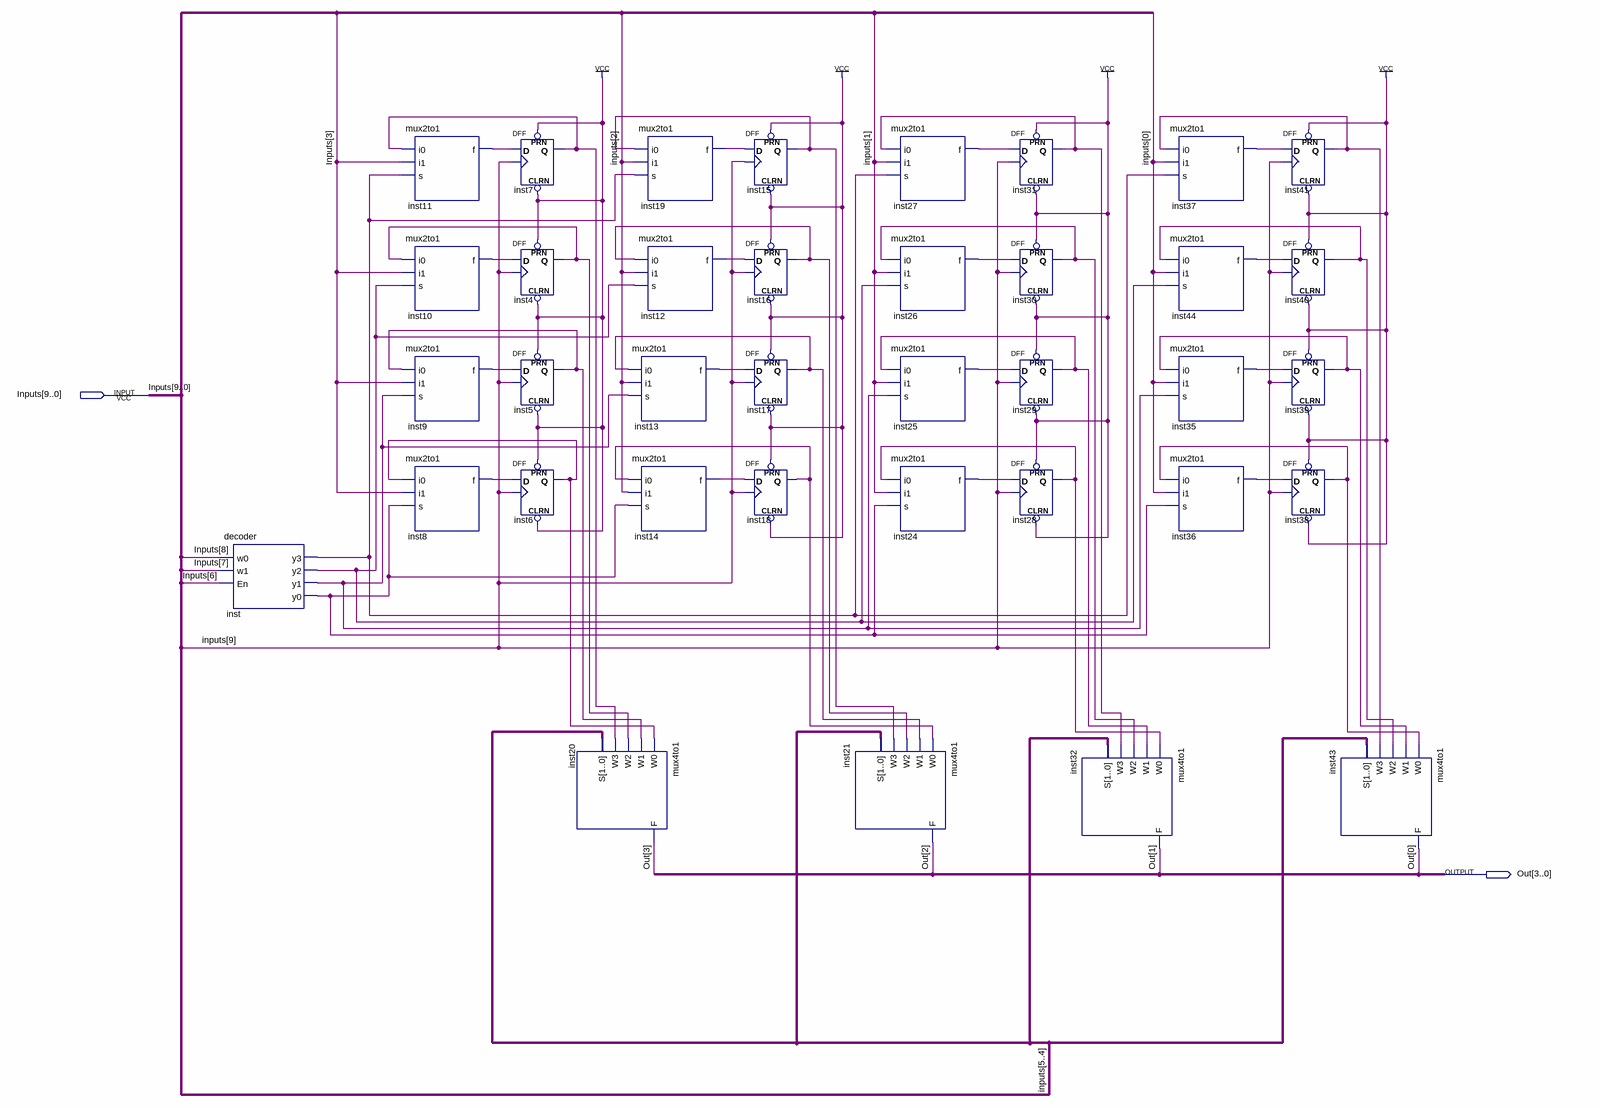
[diagram p0: schematic sheet]
// Quartus schematic regfile.bdf as structural Verilog: 37 symbols, 2 pins
module regfile (
  input  [9:0] Inputs,
  output [3:0] Out
);

  wire inst4_q, inst5_q, inst6_q, inst7_q, inst8_f, inst9_f, inst10_f, inst11_f, inst12_f, inst13_f,
       inst14_f, inst15_q, inst16_q, inst17_q, inst18_q, inst19_f, inst24_f, inst25_f, inst26_f, inst27_f,
       inst28_q, inst29_q, inst30_q, inst31_q, inst35_f, inst36_f, inst37_f, inst38_q, inst39_q, inst40_q,
       inst41_q, inst44_f, inst_y0, inst_y1, inst_y2, inst_y3;

  decoder inst (.w0(Inputs[8]), .w1(Inputs[7]), .En(Inputs[6]), .y3(inst_y3), .y2(inst_y2), .y1(inst_y1), .y0(inst_y0));
  mux2to1 inst11 (.i0(inst7_q), .i1(Inputs[3]), .s(inst_y3), .f(inst11_f));
  mux2to1 inst10 (.i0(inst4_q), .i1(Inputs[3]), .s(inst_y2), .f(inst10_f));
  mux2to1 inst9 (.i0(inst5_q), .i1(Inputs[3]), .s(inst_y1), .f(inst9_f));
  mux2to1 inst8 (.i0(inst6_q), .i1(Inputs[3]), .s(inst_y0), .f(inst8_f));
  DFF inst7 (.CLRN(1'b1), .CLK(Inputs[9]), .D(inst11_f), .PRN(1'b1), .Q(inst7_q));
  DFF inst4 (.CLRN(1'b1), .CLK(Inputs[9]), .D(inst10_f), .PRN(1'b1), .Q(inst4_q));
  DFF inst5 (.CLRN(1'b1), .CLK(Inputs[9]), .D(inst9_f), .PRN(1'b1), .Q(inst5_q));
  DFF inst6 (.CLRN(1'b1), .CLK(Inputs[9]), .D(inst8_f), .PRN(1'b1), .Q(inst6_q));
  mux4to1 inst20 (.W0(inst6_q), .W1(inst5_q), .W2(inst4_q), .W3(inst7_q), .S(Inputs[5:4]), .F(Out[3]));
  mux2to1 inst19 (.i0(inst15_q), .i1(Inputs[2]), .s(inst_y3), .f(inst19_f));
  mux2to1 inst12 (.i0(inst16_q), .i1(Inputs[2]), .s(inst_y2), .f(inst12_f));
  mux2to1 inst13 (.i0(inst17_q), .i1(Inputs[2]), .s(inst_y1), .f(inst13_f));
  mux2to1 inst14 (.i0(inst18_q), .i1(Inputs[2]), .s(inst_y0), .f(inst14_f));
  DFF inst15 (.CLRN(1'b1), .CLK(Inputs[9]), .D(inst19_f), .PRN(1'b1), .Q(inst15_q));
  DFF inst16 (.CLRN(1'b1), .CLK(Inputs[9]), .D(inst12_f), .PRN(1'b1), .Q(inst16_q));
  DFF inst17 (.CLRN(1'b1), .CLK(Inputs[9]), .D(inst13_f), .PRN(1'b1), .Q(inst17_q));
  DFF inst18 (.CLRN(1'b1), .CLK(Inputs[9]), .D(inst14_f), .PRN(1'b1), .Q(inst18_q));
  mux4to1 inst21 (.W0(inst18_q), .W1(inst17_q), .W2(inst16_q), .W3(inst15_q), .S(Inputs[5:4]), .F(Out[2]));
  mux2to1 inst27 (.i0(inst31_q), .i1(Inputs[1]), .s(inst_y3), .f(inst27_f));
  mux2to1 inst26 (.i0(inst30_q), .i1(Inputs[1]), .s(inst_y2), .f(inst26_f));
  mux2to1 inst25 (.i0(inst29_q), .i1(Inputs[1]), .s(inst_y1), .f(inst25_f));
  mux2to1 inst24 (.i0(inst28_q), .i1(Inputs[1]), .s(inst_y0), .f(inst24_f));
  DFF inst31 (.CLRN(1'b1), .CLK(Inputs[9]), .D(inst27_f), .PRN(1'b1), .Q(inst31_q));
  DFF inst30 (.CLRN(1'b1), .CLK(Inputs[9]), .D(inst26_f), .PRN(1'b1), .Q(inst30_q));
  DFF inst29 (.CLRN(1'b1), .CLK(Inputs[9]), .D(inst25_f), .PRN(1'b1), .Q(inst29_q));
  DFF inst28 (.CLRN(1'b1), .CLK(Inputs[9]), .D(inst24_f), .PRN(1'b1), .Q(inst28_q));
  mux4to1 inst32 (.W0(inst28_q), .W1(inst29_q), .W2(inst30_q), .W3(inst31_q), .S(Inputs[5:4]), .F(Out[1]));
  mux2to1 inst37 (.i0(inst41_q), .i1(Inputs[0]), .s(inst_y3), .f(inst37_f));
  mux2to1 inst44 (.i0(inst40_q), .i1(Inputs[0]), .s(inst_y2), .f(inst44_f));
  mux2to1 inst35 (.i0(inst39_q), .i1(Inputs[0]), .s(inst_y1), .f(inst35_f));
  mux2to1 inst36 (.i0(inst38_q), .i1(Inputs[0]), .s(inst_y0), .f(inst36_f));
  DFF inst41 (.CLRN(1'b1), .CLK(Inputs[9]), .D(inst37_f), .PRN(1'b1), .Q(inst41_q));
  DFF inst40 (.CLRN(1'b1), .CLK(Inputs[9]), .D(inst44_f), .PRN(1'b1), .Q(inst40_q));
  DFF inst39 (.CLRN(1'b1), .CLK(Inputs[9]), .D(inst35_f), .PRN(1'b1), .Q(inst39_q));
  DFF inst38 (.CLRN(1'b1), .CLK(Inputs[9]), .D(inst36_f), .PRN(1'b1), .Q(inst38_q));
  mux4to1 inst43 (.W0(inst38_q), .W1(inst39_q), .W2(inst40_q), .W3(inst41_q), .S(Inputs[5:4]), .F(Out[0]));
endmodule
